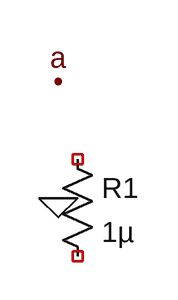
[diagram p0: schematic micro_utf8_v41.asc]
micro_utf8_v41.asc, the LTspice schematic file:
Version 4.1
SHEET 1 880 680
SYMBOL res 96 144 R0
SYMATTR InstName R1
SYMATTR Value 1µ
FLAG 96 96 a
FLAG 96 192 0

The netlist it stands for:
* micro_utf8_v41.asc
R1 NC_01 NC_02 1µ
.backanno
.end